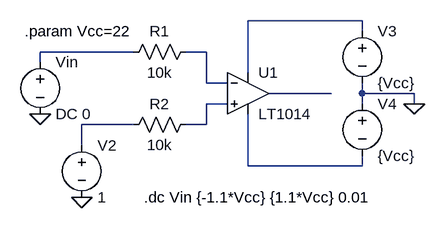
[diagram p0: schematic scheme7.asc]
scheme7.asc, the LTspice schematic file:
Version 4.1
SHEET 1 880 680
WIRE 416 48 240 48
WIRE 416 64 416 48
WIRE 64 96 -80 96
WIRE 176 96 144 96
WIRE -80 112 -80 96
WIRE 240 128 240 48
WIRE 176 144 176 96
WIRE 208 144 176 144
WIRE 368 160 272 160
WIRE 416 160 416 144
WIRE 496 160 416 160
WIRE 208 176 176 176
WIRE 416 176 416 160
WIRE 496 176 496 160
WIRE 64 208 -16 208
WIRE 176 208 176 176
WIRE 176 208 144 208
WIRE -16 240 -16 208
WIRE 240 272 240 192
WIRE 416 272 416 256
WIRE 416 272 240 272
FLAG 496 176 0
FLAG -16 320 0
FLAG -80 192 0
SYMBOL res 160 80 R90
WINDOW 0 0 56 VBottom 2
WINDOW 3 32 56 VTop 2
SYMATTR InstName R1
SYMATTR Value 10k
SYMBOL res 160 192 R90
WINDOW 0 0 56 VBottom 2
WINDOW 3 32 56 VTop 2
SYMATTR InstName R2
SYMATTR Value 10k
SYMBOL OpAmps\\LT1014 240 96 R0
SYMATTR InstName U1
SYMBOL voltage -80 96 R0
SYMATTR InstName Vin
SYMATTR Value DC 0
SYMBOL voltage -16 224 R0
SYMATTR InstName V2
SYMATTR Value 1
SYMBOL voltage 416 48 R0
SYMATTR InstName V3
SYMATTR Value {Vcc}
SYMBOL voltage 416 160 R0
SYMATTR InstName V4
SYMATTR Value {Vcc}
TEXT 80 320 Left 2 !.dc Vin {-1.1*Vcc} {1.1*Vcc} 0.01
TEXT -104 64 Left 2 !.param Vcc=22

The netlist it stands for:
* scheme7.asc
R1 N003 N002 10k
R2 N005 N006 10k
X§U1 N005 N003 N001 N007 N004 LT1014  ; pins In+ In- V+ V- OUT
Vin N002 0 DC 0
V2 N006 0 1
V3 N001 0 {Vcc}
V4 0 N007 {Vcc}
.dc Vin {-1.1*Vcc} {1.1*Vcc} 0.01
.param Vcc=22
.backanno
.end